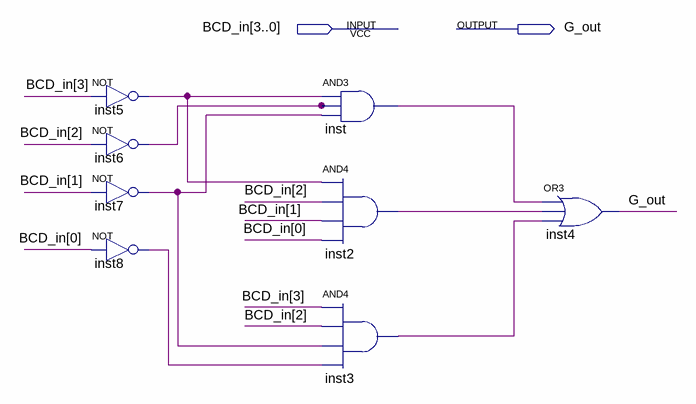
[diagram p0: schematic sheet]
// Quartus schematic G.bdf as structural Verilog: 8 symbols, 2 pins
module G (
  input  [3:0] BCD_in,
  output G_out
);

  wire inst2_out, inst3_out, inst5_out, inst6_out, inst7_out, inst8_out, inst_out;

  not inst5 (inst5_out, BCD_in[3]);
  not inst6 (inst6_out, BCD_in[2]);
  not inst7 (inst7_out, BCD_in[1]);
  not inst8 (inst8_out, BCD_in[0]);
  and inst (inst_out, inst5_out, inst6_out, inst7_out);
  and inst2 (inst2_out, inst5_out, BCD_in[2], BCD_in[1], BCD_in[0]);
  and inst3 (inst3_out, BCD_in[3], BCD_in[2], inst7_out, inst8_out);
  or inst4 (G_out, inst_out, inst2_out, inst3_out);
endmodule
